# EAGLE design OSSIDevBoard (EAGLE 6.1)
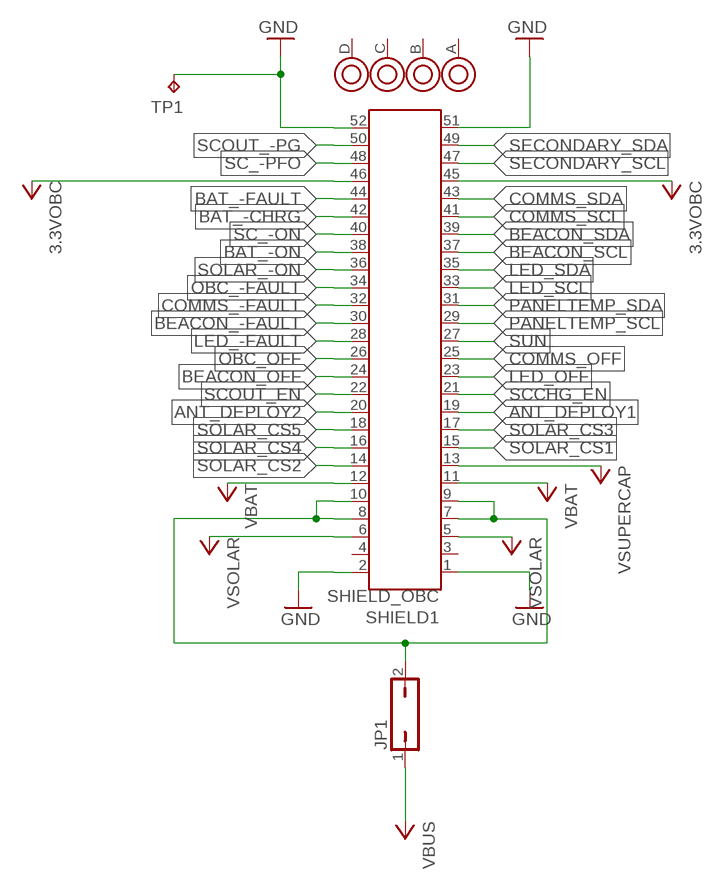
[diagram p0: schematic, sheet 1, part 1 of 2]
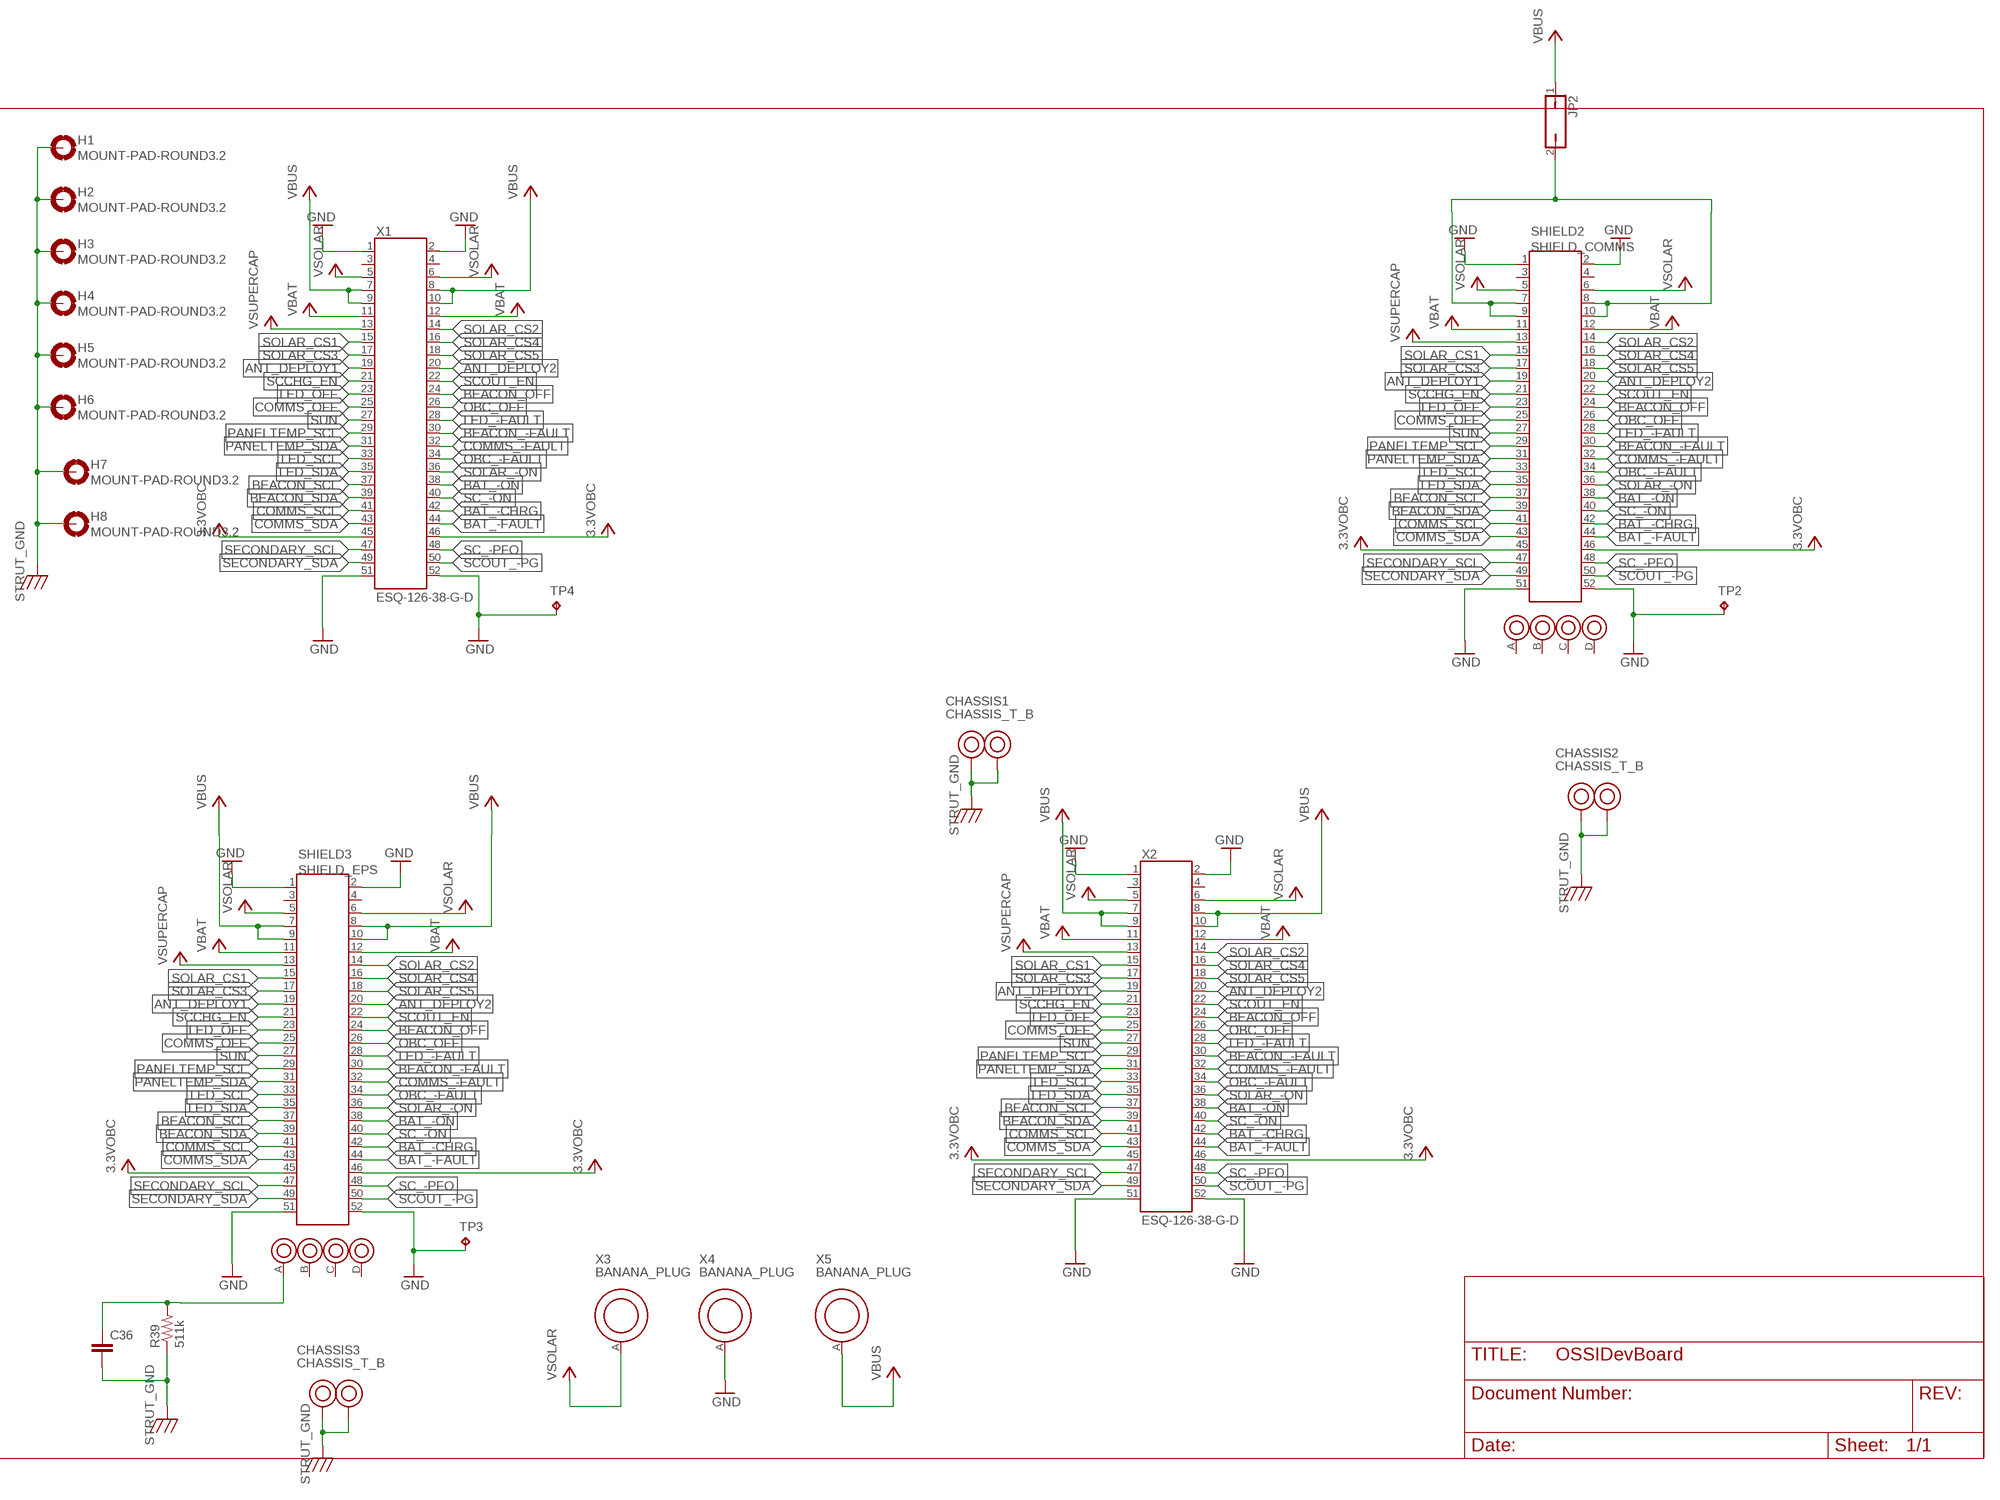
[diagram p1: schematic, sheet 1, part 2 of 2]

## Parts
C36  C0805(2012)  [C0805(2012)]
CHASSIS1  CHASSIS_T_B  [CHASSIS_T_B]
CHASSIS2  CHASSIS_T_B  [CHASSIS_T_B]
CHASSIS3  CHASSIS_T_B  [CHASSIS_T_B]
H1  MOUNT-PAD-ROUND3.2  [3.2-PAD-ROUND]
H2  MOUNT-PAD-ROUND3.2  [3.2-PAD-ROUND]
H3  MOUNT-PAD-ROUND3.2  [3.2-PAD-ROUND]
H4  MOUNT-PAD-ROUND3.2  [3.2-PAD-ROUND]
H5  MOUNT-PAD-ROUND3.2  [3.2-PAD-ROUND]
H6  MOUNT-PAD-ROUND3.2  [3.2-PAD-ROUND]
H7  MOUNT-PAD-ROUND3.2  [3.2-PAD-ROUND]
H8  MOUNT-PAD-ROUND3.2  [3.2-PAD-ROUND]
JP1  JP1Q  [JP1]
JP2  JP1Q  [JP1]
R39  511k  R0805(2012)  [R0805(2012)]
SHIELD1  SHIELD_OBC  [OBC_SHIELD]
SHIELD2  SHIELD_COMMS  [COMMS_SHIELD]
SHIELD3  SHIELD_EPS  [EPS_SHIELD]
TP1  TP  [TP-13]
TP2  TP  [TP-13]
TP3  TP  [TP-13]
TP4  TP  [TP-13]
X1  ESQ-126-38-G-D  [ESQ-126-XX-X-D]
X2  ESQ-126-38-G-D  [ESQ-126-XX-X-D]
X3  BANANA_PLUG  [BANANA_PLUG]
X4  BANANA_PLUG  [BANANA_PLUG]
X5  BANANA_PLUG  [BANANA_PLUG]

## Nets
3.3VOBC: SHIELD1.45 SHIELD1.46 SHIELD2.45 SHIELD2.46 SHIELD3.45 SHIELD3.46 X1.45 X1.46 X2.45 X2.46
ANT_DEPLOY1: SHIELD1.19 SHIELD2.19 SHIELD3.19 X1.19 X2.19
ANT_DEPLOY2: SHIELD1.20 SHIELD2.20 SHIELD3.20 X1.20 X2.20
BAT_-CHRG: SHIELD1.42 SHIELD2.42 SHIELD3.42 X1.42 X2.42
BAT_-FAULT: SHIELD1.44 SHIELD2.44 SHIELD3.44 X1.44 X2.44
BAT_-ON: SHIELD1.38 SHIELD2.38 SHIELD3.38 X1.38 X2.38
BEACON_-FAULT: SHIELD1.30 SHIELD2.30 SHIELD3.30 X1.30 X2.30
BEACON_OFF: SHIELD1.24 SHIELD2.24 SHIELD3.24 X1.24 X2.24
BEACON_SCL: SHIELD1.37 SHIELD2.37 SHIELD3.37 X1.37 X2.37
BEACON_SDA: SHIELD1.39 SHIELD2.39 SHIELD3.39 X1.39 X2.39
COMMS_-FAULT: SHIELD1.32 SHIELD2.32 SHIELD3.32 X1.32 X2.32
COMMS_OFF: SHIELD1.25 SHIELD2.25 SHIELD3.25 X1.25 X2.25
COMMS_SCL: SHIELD1.41 SHIELD2.41 SHIELD3.41 X1.41 X2.41
COMMS_SDA: SHIELD1.43 SHIELD2.43 SHIELD3.43 X1.43 X2.43
GND: SHIELD1.1 SHIELD1.2 SHIELD1.51 SHIELD1.52 SHIELD2.1 SHIELD2.2 SHIELD2.51 SHIELD2.52 SHIELD3.1 SHIELD3.2 SHIELD3.51 SHIELD3.52 TP1.TP TP2.TP TP3.TP TP4.TP X1.1 X1.2 X1.51 X1.52 X2.1 X2.2 X2.51 X2.52 X4.A
LED_-FAULT: SHIELD1.28 SHIELD2.28 SHIELD3.28 X1.28 X2.28
LED_OFF: SHIELD1.23 SHIELD2.23 SHIELD3.23 X1.23 X2.23
LED_SCL: SHIELD1.33 SHIELD2.33 SHIELD3.33 X1.33 X2.33
LED_SDA: SHIELD1.35 SHIELD2.35 SHIELD3.35 X1.35 X2.35
N$1: JP1.2 SHIELD1.7 SHIELD1.8 SHIELD1.9 SHIELD1.10
N$2: JP2.2 SHIELD2.7 SHIELD2.8 SHIELD2.9 SHIELD2.10
OBC_-FAULT: SHIELD1.34 SHIELD2.34 SHIELD3.34 X1.34 X2.34
OBC_OFF: SHIELD1.26 SHIELD2.26 SHIELD3.26 X1.26 X2.26
PANELTEMP_SCL: SHIELD1.29 SHIELD2.29 SHIELD3.29 X1.29 X2.29
PANELTEMP_SDA: SHIELD1.31 SHIELD2.31 SHIELD3.31 X1.31 X2.31
SC_-ON: SHIELD1.40 SHIELD2.40 SHIELD3.40 X1.40 X2.40
SC_-PFO: SHIELD1.48 SHIELD2.48 SHIELD3.48 X1.48 X2.48
SCCHG_EN: SHIELD1.21 SHIELD2.21 SHIELD3.21 X1.21 X2.21
SCOUT_-PG: SHIELD1.50 SHIELD2.50 SHIELD3.50 X1.50 X2.50
SCOUT_EN: SHIELD1.22 SHIELD2.22 SHIELD3.22 X1.22 X2.22
SECONDARY_SCL: SHIELD1.47 SHIELD2.47 SHIELD3.47 X1.47 X2.47
SECONDARY_SDA: SHIELD1.49 SHIELD2.49 SHIELD3.49 X1.49 X2.49
SOLAR_-ON: SHIELD1.36 SHIELD2.36 SHIELD3.36 X1.36 X2.36
SOLAR_CS1: SHIELD1.15 SHIELD2.15 SHIELD3.15 X1.15 X2.15
SOLAR_CS2: SHIELD1.14 SHIELD2.14 SHIELD3.14 X1.14 X2.14
SOLAR_CS3: SHIELD1.17 SHIELD2.17 SHIELD3.17 X1.17 X2.17
SOLAR_CS4: SHIELD1.16 SHIELD2.16 SHIELD3.16 X1.16 X2.16
SOLAR_CS5: SHIELD1.18 SHIELD2.18 SHIELD3.18 X1.18 X2.18
STRUT_GND: C36.2 CHASSIS1.A CHASSIS1.B CHASSIS2.A CHASSIS2.B CHASSIS3.A CHASSIS3.B H1.B3,2(MOUNT) H2.B3,2(MOUNT) H3.B3,2(MOUNT) H4.B3,2(MOUNT) H5.B3,2(MOUNT) H6.B3,2(MOUNT) H7.B3,2(MOUNT) H8.B3,2(MOUNT) R39.1
STRUT_GND1: C36.1 R39.2 SHIELD3.A
SUN: SHIELD1.27 SHIELD2.27 SHIELD3.27 X1.27 X2.27
VBAT: SHIELD1.11 SHIELD1.12 SHIELD2.11 SHIELD2.12 SHIELD3.11 SHIELD3.12 X1.11 X1.12 X2.11 X2.12
VBUS: JP1.1 JP2.1 SHIELD3.7 SHIELD3.8 SHIELD3.9 SHIELD3.10 X1.7 X1.8 X1.9 X1.10 X2.7 X2.8 X2.9 X2.10 X5.A
VSOLAR: SHIELD1.5 SHIELD1.6 SHIELD2.5 SHIELD2.6 SHIELD3.5 SHIELD3.6 X1.5 X1.6 X2.5 X2.6 X3.A
VSUPERCAP: SHIELD1.13 SHIELD2.13 SHIELD3.13 X1.13 X2.13
Unconnected: SHIELD1.3 SHIELD1.4 SHIELD1.A SHIELD1.B SHIELD1.C SHIELD1.D SHIELD2.3 SHIELD2.4 SHIELD2.A SHIELD2.B SHIELD2.C SHIELD2.D SHIELD3.3 SHIELD3.4 SHIELD3.B SHIELD3.C SHIELD3.D X1.3 X1.4 X2.3 X2.4

## Library data of the parts
C36 = OSSI:C
CHASSIS1-CHASSIS3 = OSSI:CHASSIS_T_B
H1-H8 = OSSI:MOUNT-PAD-ROUND
JP1 JP2 = OSSI:JP1Q: JUMPER
R39 = OSSI:R
SHIELD1-SHIELD3 = OSSI:SHIELD
TP1-TP4 = OSSI:TP
X1 X2 = OSSI:ESQ-126-: Samtec ESQ-126-XX-G-D Elevated Sockets Seires ESQ-126-37-G-D ESQ-126-38-G-D ESQ-126-39-G-D
X3-X5 = OSSI:BANANA

## Board
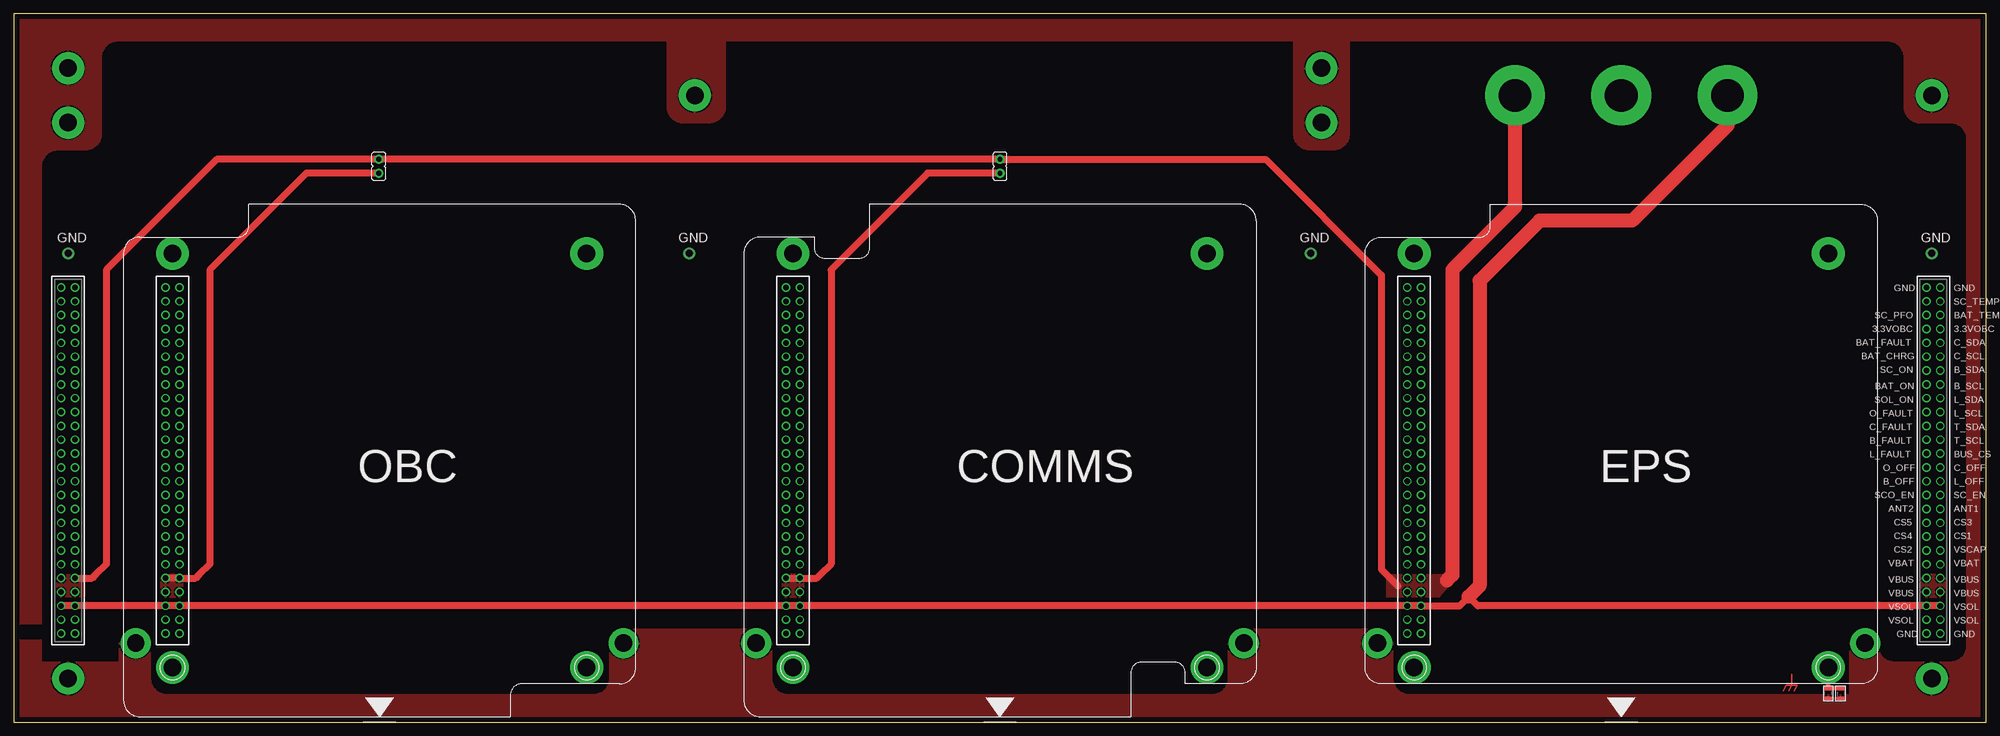
[diagram p2: board, top side]
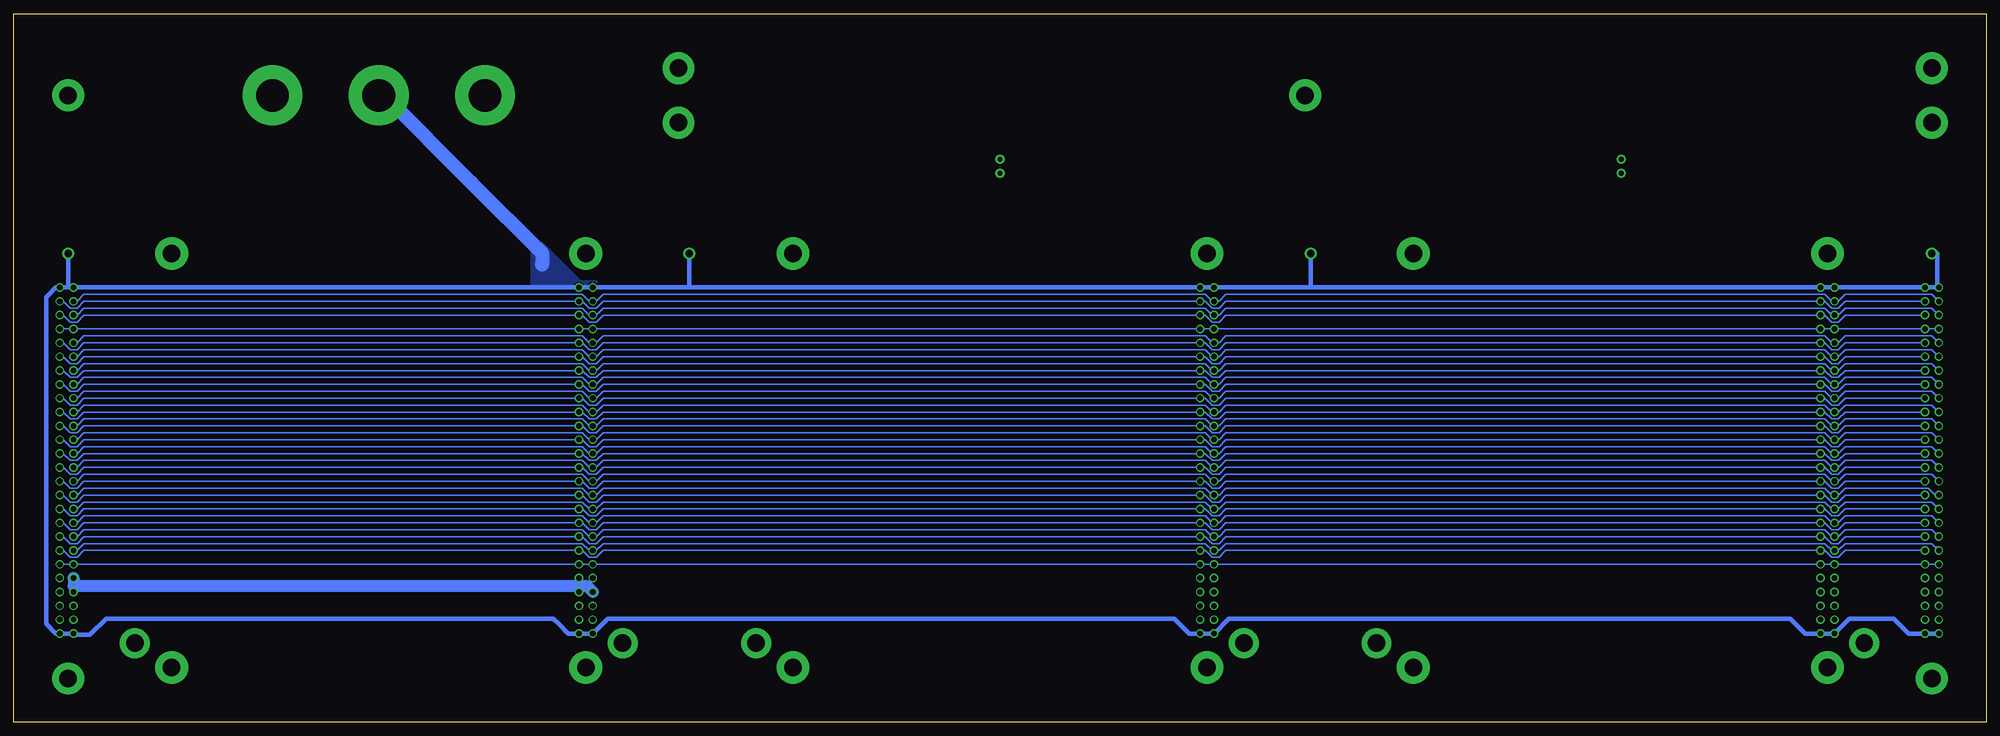
[diagram p3: board, bottom side, seen from below]

Size 362 x 130 mm. Coordinates in mm from the lower left corner, seen from the top.
Outline: 0,0 362,0 362,130 0,130 0,0
Copper layers (1*16): Top 0.035mm / dielectric 1.5mm / Bottom 0.035mm
Design rules: minimum track width 10mil, minimum drill 16mil, track to track 8mil, track to pad 8mil, pad to pad 8mil, via to via 8mil, smd to smd 8mil, copper to edge 40mil, drill to drill 8mil, minimum pad ring 10mil, minimum via ring 8mil, stop-mask expansion 4mil, vias tented up to drill 0mil, thermal gap 10mil

### Footprints (pad centres in the part's own frame; a part is rotated, then mirrored left to right if it is on the bottom)
C0805(2012) = smd 0.7 x 1.5: 1 -0.95,0; 2 0.95,0
CHASSIS_T_B = drill 3.2 pad 5.5: A 3.25,14.5; B 92.75,14.5
3.2-PAD-ROUND = drill 3.2 pad 5.842: B3,2 0,0
JP1 = drill 0.914 pad 1.676: 1 0,-1.27; 2 0,1.27
R0805(2012) = smd 0.7 x 1.5: 1 -0.95,0; 2 0.95,0
OBC_SHIELD = drill 1.016 pad 1.524: 1 10.27,15.25; 2 7.73,15.25; 3 10.27,17.79; 4 7.73,17.79; 5 10.27,20.33; 6 7.73,20.33; 7 10.27,22.87; 8 7.73,22.87; 9 10.27,25.41; 10 7.73,25.41; 11 10.27,27.95; 12 7.73,27.95; 13 10.27,30.49; 14 7.73,30.49; 15 10.27,33.03; 16 7.73,33.03; 17 10.27,35.57; 18 7.73,35.57; 19 10.27,38.11; 20 7.73,38.11; 21 10.27,40.65; 22 7.73,40.65; 23 10.27,43.19; 24 7.73,43.19; 25 10.27,45.73; 26 7.73,45.73; 27 10.27,48.27; 28 7.73,48.27; 29 10.27,50.81; 30 7.73,50.81; 31 10.27,53.35; 32 7.73,53.35; 33 10.27,55.89; 34 7.73,55.89; 35 10.27,58.43; 36 7.73,58.43; 37 10.27,60.97; 38 7.73,60.97; 39 10.27,63.51; 40 7.73,63.51; 41 10.27,66.05; 42 7.73,66.05; 43 10.27,68.59; 44 7.73,68.59; 45 10.27,71.13; 46 7.73,71.13; 47 10.27,73.67; 48 7.73,73.67; 49 10.27,76.21; 50 7.73,76.21; 51 10.27,78.75; 52 7.73,78.75 | drill 3.2 pad 6: A 85,9; B 85,85; C 9,85; D 9,9
COMMS_SHIELD = drill 1.016 pad 1.524: 1 10.27,15.25; 2 7.73,15.25; 3 10.27,17.79; 4 7.73,17.79; 5 10.27,20.33; 6 7.73,20.33; 7 10.27,22.87; 8 7.73,22.87; 9 10.27,25.41; 10 7.73,25.41; 11 10.27,27.95; 12 7.73,27.95; 13 10.27,30.49; 14 7.73,30.49; 15 10.27,33.03; 16 7.73,33.03; 17 10.27,35.57; 18 7.73,35.57; 19 10.27,38.11; 20 7.73,38.11; 21 10.27,40.65; 22 7.73,40.65; 23 10.27,43.19; 24 7.73,43.19; 25 10.27,45.73; 26 7.73,45.73; 27 10.27,48.27; 28 7.73,48.27; 29 10.27,50.81; 30 7.73,50.81; 31 10.27,53.35; 32 7.73,53.35; 33 10.27,55.89; 34 7.73,55.89; 35 10.27,58.43; 36 7.73,58.43; 37 10.27,60.97; 38 7.73,60.97; 39 10.27,63.51; 40 7.73,63.51; 41 10.27,66.05; 42 7.73,66.05; 43 10.27,68.59; 44 7.73,68.59; 45 10.27,71.13; 46 7.73,71.13; 47 10.27,73.67; 48 7.73,73.67; 49 10.27,76.21; 50 7.73,76.21; 51 10.27,78.75; 52 7.73,78.75 | drill 3.2 pad 6: A 85,9; B 85,85; C 9,85; D 9,9
EPS_SHIELD = drill 1.016 pad 1.524: 1 10.27,9.25; 2 7.73,9.25; 3 10.27,11.79; 4 7.73,11.79; 5 10.27,14.33; 6 7.73,14.33; 7 10.27,16.87; 8 7.73,16.87; 9 10.27,19.41; 10 7.73,19.41; 11 10.27,21.95; 12 7.73,21.95; 13 10.27,24.49; 14 7.73,24.49; 15 10.27,27.03; 16 7.73,27.03; 17 10.27,29.57; 18 7.73,29.57; 19 10.27,32.11; 20 7.73,32.11; 21 10.27,34.65; 22 7.73,34.65; 23 10.27,37.19; 24 7.73,37.19; 25 10.27,39.73; 26 7.73,39.73; 27 10.27,42.27; 28 7.73,42.27; 29 10.27,44.81; 30 7.73,44.81; 31 10.27,47.35; 32 7.73,47.35; 33 10.27,49.89; 34 7.73,49.89; 35 10.27,52.43; 36 7.73,52.43; 37 10.27,54.97; 38 7.73,54.97; 39 10.27,57.51; 40 7.73,57.51; 41 10.27,60.05; 42 7.73,60.05; 43 10.27,62.59; 44 7.73,62.59; 45 10.27,65.13; 46 7.73,65.13; 47 10.27,67.67; 48 7.73,67.67; 49 10.27,70.21; 50 7.73,70.21; 51 10.27,72.75; 52 7.73,72.75 | drill 3.2 pad 6: A 85,3; B 85,79; C 9,79; D 9,3
TP-13 = drill 1.321 pad 2.159: TP 0,0
ESQ-126-XX-X-D = drill 1.016 pad 1.524: 1 -1.27,31.75; 2 1.27,31.75; 3 -1.27,29.21; 4 1.27,29.21; 5 -1.27,26.67; 6 1.27,26.67; 7 -1.27,24.13; 8 1.27,24.13; 9 -1.27,21.59; 10 1.27,21.59; 11 -1.27,19.05; 12 1.27,19.05; 13 -1.27,16.51; 14 1.27,16.51; 15 -1.27,13.97; 16 1.27,13.97; 17 -1.27,11.43; 18 1.27,11.43; 19 -1.27,8.89; 20 1.27,8.89; 21 -1.27,6.35; 22 1.27,6.35; 23 -1.27,3.81; 24 1.27,3.81; 25 -1.27,1.27; 26 1.27,1.27; 27 -1.27,-1.27; 28 1.27,-1.27; 29 -1.27,-3.81; 30 1.27,-3.81; 31 -1.27,-6.35; 32 1.27,-6.35; 33 -1.27,-8.89; 34 1.27,-8.89; 35 -1.27,-11.43; 36 1.27,-11.43; 37 -1.27,-13.97; 38 1.27,-13.97; 39 -1.27,-16.51; 40 1.27,-16.51; 41 -1.27,-19.05; 42 1.27,-19.05; 43 -1.27,-21.59; 44 1.27,-21.59; 45 -1.27,-24.13; 46 1.27,-24.13; 47 -1.27,-26.67; 48 1.27,-26.67; 49 -1.27,-29.21; 50 1.27,-29.21; 51 -1.27,-31.75; 52 1.27,-31.75
BANANA_PLUG = drill 6 pad 11: A 0,0

### Placement (x,y rotation side)
C36  335.25,5.25 270 top
CHASSIS1  19.16,0 0 top
CHASSIS2  133,0 0 top
CHASSIS3  247,0 0 top
H1  10,110 0 top
H2  10,8 0 top
H3  352,8 0 top
H4  352,115 0 top
H5  240,110 0 top
H6  240,120 0 top
H7  125,115 0 top
H8  10,120 0 top
JP1  67,102 180 top
JP2  181,102 180 top
R39  333,5.25 90 top
SHIELD1  20.16,1 0 top
SHIELD2  134,1 0 top
SHIELD3  248,7 0 top
TP1  124,86 0 top
TP2  238,86 0 top
TP3  352,86 0 top
TP4  10,86 0 top
X1  10,48 180 top
X2  352.26,48 180 top
X3  314.5,115 0 top
X4  295,115 0 top
X5  275.5,115 0 top

### Tracks (layer width: path | path; a pad name or v marks a point on that pad's centre or on a via)
3.3VOBC
  Bottom 0.254: X1.46 X1.45 SHIELD1.46 SHIELD1.45 SHIELD2.46 143.35,72.13 SHIELD2.45 SHIELD3.46 SHIELD3.45 X2.46 X2.45
ANT_DEPLOY1
  Bottom 0.254: X2.19 352.9,39.11 351.63,37.84 350.36,37.84 349.09,39.11 SHIELD3.19 257.65,39.11 256.38,37.84 255.11,37.84 253.84,39.11 SHIELD2.19 143.35,39.11 142.08,37.84 140.81,37.84 139.54,39.11 SHIELD1.19 29.68,39.11 28.41,37.84 27.14,37.84 25.88,39.11 X1.19
ANT_DEPLOY2
  Bottom 0.254: X2.20 350.36,39.11 349.09,40.38 257.65,40.38 256.38,39.11 SHIELD3.20 255.11,39.11 253.84,40.38 143.35,40.38 142.08,39.11 SHIELD2.20 140.81,39.11 139.54,40.38 29.68,40.38 28.41,39.11 SHIELD1.20 27.14,39.11 25.88,40.38 10,40.38 X1.20
BAT_-CHRG
  Bottom 0.254: X2.42 350.36,67.05 349.09,68.32 257.65,68.32 256.38,67.05 SHIELD3.42 255.11,67.05 253.84,68.32 143.35,68.32 142.08,67.05 SHIELD2.42 140.81,67.05 139.54,68.32 29.68,68.32 28.41,67.05 SHIELD1.42 27.14,67.05 25.88,68.32 10,68.32 X1.42
BAT_-FAULT
  Bottom 0.254: X2.44 350.36,69.59 349.09,70.86 257.65,70.86 256.38,69.59 SHIELD3.44 255.11,69.59 253.84,70.86 149.7,70.86 143.35,70.86 142.08,69.59 SHIELD2.44 140.81,69.59 139.54,70.86 29.68,70.86 28.41,69.59 SHIELD1.44 27.78,69.59 27.14,69.59 25.88,70.86 10,70.86 X1.44
BAT_-ON
  Bottom 0.254: X2.38 350.36,61.97 349.09,63.24 257.65,63.24 256.38,61.97 SHIELD3.38 255.11,61.97 253.84,63.24 143.35,63.24 142.08,61.97 SHIELD2.38 140.81,61.97 139.54,63.24 29.68,63.24 28.41,61.97 SHIELD1.38 27.14,61.97 25.88,63.24 10,63.24 X1.38
BEACON_-FAULT
  Bottom 0.254: X2.30 350.36,51.81 349.09,53.08 257.65,53.08 256.38,51.81 SHIELD3.30 255.11,51.81 253.84,53.08 143.35,53.08 142.08,51.81 SHIELD2.30 140.81,51.81 139.54,53.08 29.68,53.08 28.41,51.81 SHIELD1.30 27.14,51.81 25.88,53.08 10,53.08 X1.30
BEACON_OFF
  Bottom 0.254: X2.24 350.36,44.19 349.09,45.46 257.65,45.46 256.38,44.19 SHIELD3.24 255.11,44.19 253.84,45.46 143.35,45.46 142.08,44.19 SHIELD2.24 140.81,44.19 139.54,45.46 29.68,45.46 28.41,44.19 SHIELD1.24 27.14,44.19 25.88,45.46 10,45.46 X1.24
BEACON_SCL
  Bottom 0.254: X2.37 352.9,61.97 351.63,60.7 350.36,60.7 349.09,61.97 SHIELD3.37 257.65,61.97 256.38,60.7 255.11,60.7 253.84,61.97 SHIELD2.37 143.35,61.97 142.08,60.7 140.81,60.7 139.54,61.97 SHIELD1.37 29.68,61.97 28.41,60.7 27.14,60.7 25.88,61.97 X1.37
BEACON_SDA
  Bottom 0.254: X2.39 352.9,64.51 351.63,63.24 350.36,63.24 349.09,64.51 SHIELD3.39 257.65,64.51 256.38,63.24 255.11,63.24 253.84,64.51 SHIELD2.39 143.35,64.51 142.08,63.24 140.81,63.24 139.54,64.51 SHIELD1.39 29.68,64.51 28.41,63.24 27.14,63.24 25.88,64.51 X1.39
COMMS_-FAULT
  Bottom 0.254: X2.32 350.36,54.35 349.09,55.62 257.65,55.62 256.38,54.35 SHIELD3.32 255.11,54.35 253.84,55.62 143.35,55.62 142.08,54.35 SHIELD2.32 140.81,54.35 139.54,55.62 29.68,55.62 28.41,54.35 SHIELD1.32 27.14,54.35 25.88,55.62 10,55.62 X1.32
COMMS_OFF
  Bottom 0.254: X2.25 352.9,46.73 351.63,45.46 350.36,45.46 349.09,46.73 SHIELD3.25 257.65,46.73 256.38,45.46 255.11,45.46 253.84,46.73 SHIELD2.25 143.35,46.73 142.08,45.46 140.81,45.46 139.54,46.73 SHIELD1.25 29.68,46.73 28.41,45.46 27.14,45.46 25.88,46.73 X1.25
COMMS_SCL
  Bottom 0.254: X2.41 352.9,67.05 351.63,65.78 350.36,65.78 349.09,67.05 SHIELD3.41 257.65,67.05 256.38,65.78 255.11,65.78 253.84,67.05 SHIELD2.41 143.35,67.05 142.08,65.78 140.81,65.78 139.54,67.05 SHIELD1.41 29.68,67.05 28.41,65.78 27.14,65.78 25.88,67.05 X1.41
COMMS_SDA
  Bottom 0.254: SHIELD2.43 143.35,69.59 142.08,68.32 140.81,68.32 139.54,69.59 SHIELD1.43 29.68,69.59 28.41,68.32 27.14,68.32 25.88,69.59 X1.43 | SHIELD2.43 144.62,69.59 SHIELD2.43 | SHIELD2.43 253.84,69.59 255.11,68.32 256.38,68.32 257.65,69.59 SHIELD3.43 349.09,69.59 350.36,68.32 351.63,68.32 352.9,69.59 X2.43
GND
  Bottom 0.813: 352,79.75 X2.51 354.25,79.75 355.5,78.5 356,78 356,18 354.25,16.25 X2.1 X2.2 350.75,16 348,16 345,19 263,19 262,18 260.25,16.25 SHIELD3.1 SHIELD3.2 252.98,19 149,19 146.25,16.25 SHIELD2.1 SHIELD2.2 138.98,19 36,19 33.25,16.25 SHIELD1.1 SHIELD1.2 25.14,19 17,19 14.25,16.25 X1.1 X1.2 | 352,79.75 X2.52 SHIELD3.51 SHIELD3.52 238,79.75 | 238,79.75 SHIELD2.51 SHIELD2.52 124,79.75 | 124,79.75 SHIELD1.51 SHIELD1.52 X1.51 X1.52 8.73,80 9,80 9,86 TP4.TP | TP1.TP 124,79.75 | TP2.TP 238,79.75 | TP3.TP 352,79.75
  Bottom 2.54: X4.A 294,115 278,99 265,86 265,84
  pour Bottom: 267,84 267,80 267,79.5 255,79.5 255,81 258,81 265,88 267,88
LED_-FAULT
  Bottom 0.254: X2.28 350.36,49.27 349.09,50.54 257.65,50.54 256.38,49.27 SHIELD3.28 255.11,49.27 253.84,50.54 143.35,50.54 142.08,49.27 SHIELD2.28 140.81,49.27 139.54,50.54 29.68,50.54 28.41,49.27 SHIELD1.28 27.14,49.27 25.88,50.54 10,50.54 X1.28
LED_OFF
  Bottom 0.254: X2.23 352.9,44.19 351.63,42.92 350.36,42.92 349.09,44.19 SHIELD3.23 257.65,44.19 256.38,42.92 255.11,42.92 253.84,44.19 SHIELD2.23 143.35,44.19 142.08,42.92 140.81,42.92 139.54,44.19 SHIELD1.23 29.68,44.19 28.41,42.92 27.14,42.92 25.88,44.19 X1.23
LED_SCL
  Bottom 0.254: X2.33 352.9,56.89 351.63,55.62 350.36,55.62 349.09,56.89 SHIELD3.33 257.65,56.89 256.38,55.62 255.11,55.62 253.84,56.89 SHIELD2.33 143.35,56.89 142.08,55.62 140.81,55.62 139.54,56.89 SHIELD1.33 29.68,56.89 28.41,55.62 27.14,55.62 25.88,56.89 X1.33
LED_SDA
  Bottom 0.254: X2.35 352.9,59.43 351.63,58.16 350.36,58.16 349.09,59.43 SHIELD3.35 257.65,59.43 256.38,58.16 255.11,58.16 253.84,59.43 SHIELD2.35 143.35,59.43 142.08,58.16 140.81,58.16 139.54,59.43 SHIELD1.35 29.68,59.43 28.41,58.16 27.14,58.16 25.88,59.43 X1.35
N$1
  Top 1.27: JP1.2 53.73,100.73 36,83 36,29 34,27 33.41,26.41 SHIELD1.9 SHIELD1.10
  pour Top: 27,27 27,23 31,23 31,27
N$2
  Top 1.27: JP2.2 167.73,100.73 150,83 150,29 148,27 147.41,26.41 SHIELD2.9 SHIELD2.10
  pour Top: 141,27 141,23 145,23 145,27
N$3
  Top 0.254: 326.25,8.75 326.25,6.75 325.75,5.75
N$4
  Top 0.254: 324.75,5.75 325.25,6.75 327.25,6.75 326.75,5.75
OBC_-FAULT
  Bottom 0.254: X2.34 350.36,56.89 349.09,58.16 257.65,58.16 256.38,56.89 SHIELD3.34 255.11,56.89 253.84,58.16 143.35,58.16 142.08,56.89 SHIELD2.34 140.81,56.89 139.54,58.16 29.68,58.16 28.41,56.89 SHIELD1.34 27.14,56.89 25.88,58.16 10,58.16 X1.34
OBC_OFF
  Bottom 0.254: X2.26 350.36,46.73 349.09,48 257.65,48 256.38,46.73 SHIELD3.26 255.11,46.73 253.84,48 143.35,48 142.08,46.73 SHIELD2.26 140.81,46.73 139.54,48 29.68,48 28.41,46.73 SHIELD1.26 27.14,46.73 25.88,48 10,48 X1.26
PANELTEMP_SCL
  Bottom 0.254: X2.29 352.9,51.81 351.63,50.54 350.36,50.54 349.09,51.81 SHIELD3.29 257.65,51.81 256.38,50.54 255.11,50.54 253.84,51.81 SHIELD2.29 143.35,51.81 142.08,50.54 140.81,50.54 139.54,51.81 SHIELD1.29 29.68,51.81 28.41,50.54 27.14,50.54 25.88,51.81 X1.29
PANELTEMP_SDA
  Bottom 0.254: X2.31 352.9,54.35 351.63,53.08 350.36,53.08 349.09,54.35 SHIELD3.31 257.65,54.35 256.38,53.08 255.11,53.08 253.84,54.35 SHIELD2.31 143.35,54.35 142.08,53.08 140.81,53.08 139.54,54.35 SHIELD1.31 29.68,54.35 28.41,53.08 27.14,53.08 25.88,54.35 X1.31
SC_-ON
  Bottom 0.254: X2.40 350.36,64.51 349.09,65.78 257.65,65.78 256.38,64.51 SHIELD3.40 255.11,64.51 253.84,65.78 143.35,65.78 142.08,64.51 SHIELD2.40 140.81,64.51 139.54,65.78 29.68,65.78 28.41,64.51 SHIELD1.40 27.14,64.51 25.88,65.78 10,65.78 X1.40
SC_-PFO
  Bottom 0.254: X2.48 350.36,74.67 349.09,75.94 257.65,75.94 256.38,74.67 SHIELD3.48 255.11,74.67 253.84,75.94 143.35,75.94 142.08,74.67 SHIELD2.48 140.81,74.67 139.54,75.94 29.68,75.94 28.41,74.67 SHIELD1.48 27.78,74.67 27.14,74.67 25.88,75.94 10,75.94 X1.48
SCCHG_EN
  Bottom 0.254: X2.21 352.9,41.65 351.63,40.38 350.36,40.38 349.09,41.65 SHIELD3.21 257.65,41.65 256.38,40.38 255.11,40.38 253.84,41.65 SHIELD2.21 143.35,41.65 142.08,40.38 140.81,40.38 139.54,41.65 SHIELD1.21 29.68,41.65 28.41,40.38 27.14,40.38 25.88,41.65 X1.21
SCOUT_-PG
  Bottom 0.254: X2.50 350.36,77.21 349.09,78.48 257.65,78.48 256.38,77.21 SHIELD3.50 255.11,77.21 253.84,78.48 143.35,78.48 142.08,77.21 SHIELD2.50 140.81,77.21 139.54,78.48 139.19,78.48 29.68,78.48 28.41,77.21 SHIELD1.50 27.14,77.21 25.88,78.48 10,78.48 X1.50
SCOUT_EN
  Bottom 0.254: X2.22 350.36,41.65 349.09,42.92 257.65,42.92 256.38,41.65 SHIELD3.22 255.11,41.65 253.84,42.92 143.35,42.92 142.08,41.65 SHIELD2.22 140.81,41.65 139.54,42.92 29.68,42.92 28.41,41.65 SHIELD1.22 27.14,41.65 25.88,42.92 10.63,42.92 9.37,41.65 X1.22
SECONDARY_SCL
  Bottom 0.254: SHIELD2.47 144.62,74.67 | 144.62,74.67 253.84,74.67 255.11,73.4 256.38,73.4 257.65,74.67 SHIELD3.47 349.09,74.67 350.36,73.4 351.63,73.4 352.9,74.67 X2.47 | 144.62,74.67 143.35,74.67 142.08,73.4 140.81,73.4 139.54,74.67 SHIELD1.47 29.68,74.67 28.41,73.4 27.14,73.4 25.88,74.67 X1.47
SECONDARY_SDA
  Bottom 0.254: X2.49 352.9,77.21 351.63,75.94 350.36,75.94 349.09,77.21 SHIELD3.49 257.65,77.21 256.38,75.94 255.11,75.94 253.84,77.21 SHIELD2.49 143.35,77.21 142.08,75.94 140.81,75.94 139.54,77.21 SHIELD1.49 29.68,77.21 28.41,75.94 27.14,75.94 25.88,77.21 X1.49
SOLAR_-ON
  Bottom 0.254: X2.36 350.36,59.43 349.09,60.7 257.65,60.7 256.38,59.43 SHIELD3.36 255.11,59.43 253.84,60.7 143.35,60.7 142.08,59.43 SHIELD2.36 140.81,59.43 139.54,60.7 29.68,60.7 28.41,59.43 SHIELD1.36 27.14,59.43 25.88,60.7 10,60.7 X1.36
SOLAR_CS1
  Bottom 0.254: X2.15 352.9,34.03 351.63,32.76 350.36,32.76 349.09,34.03 SHIELD3.15 257.65,34.03 256.38,32.76 255.11,32.76 253.84,34.03 SHIELD2.15 143.35,34.03 142.08,32.76 140.81,32.76 139.54,34.03 SHIELD1.15 29.68,34.03 28.41,32.76 27.14,32.76 25.88,34.03 X1.15
SOLAR_CS2
  Bottom 0.254: X2.14 350.36,31.49 349.09,32.76 257.65,32.76 256.38,31.49 SHIELD3.14 255.11,31.49 253.84,32.76 143.35,32.76 142.08,31.49 SHIELD2.14 140.81,31.49 139.54,32.76 29.68,32.76 28.41,31.49 SHIELD1.14 27.14,31.49 25.88,32.76 10,32.76 X1.14
SOLAR_CS3
  Bottom 0.254: X2.17 352.9,36.57 351.63,35.3 350.36,35.3 349.09,36.57 SHIELD3.17 257.65,36.57 256.38,35.3 255.11,35.3 253.84,36.57 SHIELD2.17 143.35,36.57 142.08,35.3 140.81,35.3 139.54,36.57 SHIELD1.17 29.68,36.57 28.41,35.3 27.14,35.3 25.88,36.57 X1.17
SOLAR_CS4
  Bottom 0.254: X2.16 350.36,34.03 349.09,35.3 257.65,35.3 256.38,34.03 SHIELD3.16 255.11,34.03 253.84,35.3 143.35,35.3 142.08,34.03 SHIELD2.16 140.81,34.03 139.54,35.3 29.68,35.3 28.41,34.03 SHIELD1.16 27.14,34.03 25.88,35.3 10,35.3 X1.16
SOLAR_CS5
  Bottom 0.254: X2.18 350.36,36.57 349.09,37.84 257.65,37.84 256.38,36.57 SHIELD3.18 255.11,36.57 253.84,37.84 143.35,37.84 142.08,36.57 SHIELD2.18 140.81,36.57 139.54,37.84 29.68,37.84 28.41,36.57 SHIELD1.18 27.14,36.57 25.88,37.84 10,37.84 X1.18
STRUT_GND
  pour Top: 0,15 5,15 5,11 19.5,11 19.5,14 arc-90 22.5,17 arc-90 25,14.5 25,8 arc90 28,5 106.5,5 arc90 109.5,8 109.5,14 arc-90 112.5,17 136,17 arc-90 139,14 139,8 arc90 142,5 220,5 arc90 223,8 223,14 arc-90 226,17 250,17 arc-90 253,14 253,8 arc90 256,5 337,5 337,14 arc-90 340,17 arc-90 342,15 342,14 arc90 345,11 355.5,11 arc90 358.5,14 358.5,107 arc90 355.5,110 350,110 arc-90 347,113 347,122 arc90 344,125 245,125 245,108 arc-90 242,105 238,105 arc-90 235,108 235,125 130.5,125 130.5,113 arc-90 127.5,110 123,110 arc-90 120,113 120,125 19,125 arc90 16,122 16,108 arc-90 13,105 8,105 arc90 5,102 5,18 0,18 0,130 362,130 362,0 0,0
STRUT_GND1
  Top 0.813: SHIELD3.A R39.2 C36.1
SUN
  Bottom 0.254: X2.27 352.9,49.27 351.63,48 350.36,48 349.09,49.27 SHIELD3.27 257.65,49.27 256.38,48 255.11,48 253.84,49.27 SHIELD2.27 143.35,49.27 142.08,48 140.81,48 139.54,49.27 SHIELD1.27 29.68,49.27 28.41,48 27.14,48 25.88,49.27 X1.27
VBAT
  Bottom 0.254: X1.12 X1.11 SHIELD1.12 SHIELD1.11 SHIELD2.12 SHIELD2.11 SHIELD3.12 SHIELD3.11 X2.12 X2.11
VBUS
  Top 1.27: 254,25 251,28 251,82 229.73,103.27 JP2.1 JP1.1 37.27,103.27 17,83 17,29 15,27 14.41,26.41 X1.9
  Top 2.54: X5.A 275.5,94.5 264,83 264,27 263,26
  Bottom 2.184: X2.10 351,25 257,25 256.86,25 SHIELD3.8
  pour Top: 252,27 252,23 261.5,23 265,27
  pour Top: 8,23 8,27 13,27 13,23
  pour Top: 350,27 350,23 354.5,23 354.5,27
VSOLAR
  Top 1.27: X1.6 X1.5 SHIELD1.6 SHIELD1.5 SHIELD2.6 SHIELD2.5 SHIELD3.6 SHIELD3.5 265.33,21.33 267,23 268.67,21.33 X2.6 X2.5
  Top 2.54: X3.A 314.5,112.5 314.5,109.5 297,92 280,92 269,81 269,25 267,23
VSUPERCAP
  Bottom 0.254: X2.13 352.9,31.49 351.63,30.22 350.36,30.22 349.09,31.49 SHIELD3.13 257.65,31.49 256.38,30.22 255.11,30.22 253.84,31.49 SHIELD2.13 143.35,31.49 142.08,30.22 140.81,30.22 139.54,31.49 SHIELD1.13 29.68,31.49 28.41,30.22 27.14,30.22 25.88,31.49 X1.13

### Text on the board
tPlace: GND | GND | GND | GND | GND | GND | SC_TEMP | SC_PFO | BAT_TEMP | 3.3VOBC | 3.3VOBC | BAT_FAULT | C_SDA | BAT_CHRG | C_SCL | SC_ON | B_SDA | BAT_ON | B_SCL | SOL_ON | L_SDA | O_FAULT | L_SCL | C_FAULT | T_SDA | B_FAULT | T_SCL | L_FAULT | BUS_CS | O_OFF | C_OFF | B_OFF | L_OFF | SCO_EN | SC_EN | ANT2 | ANT1 | CS5 | CS3 | CS4 | CS1 | CS2 | VSCAP | VBAT | VBAT | VBUS | VBUS | VBUS | VBUS | VSOL | VSOL | VSOL | VSOL | GND | GND